# Altium schematic sheet Chipset.SchDoc
size A2; SheetNumber: 1; SheetTotal: 8
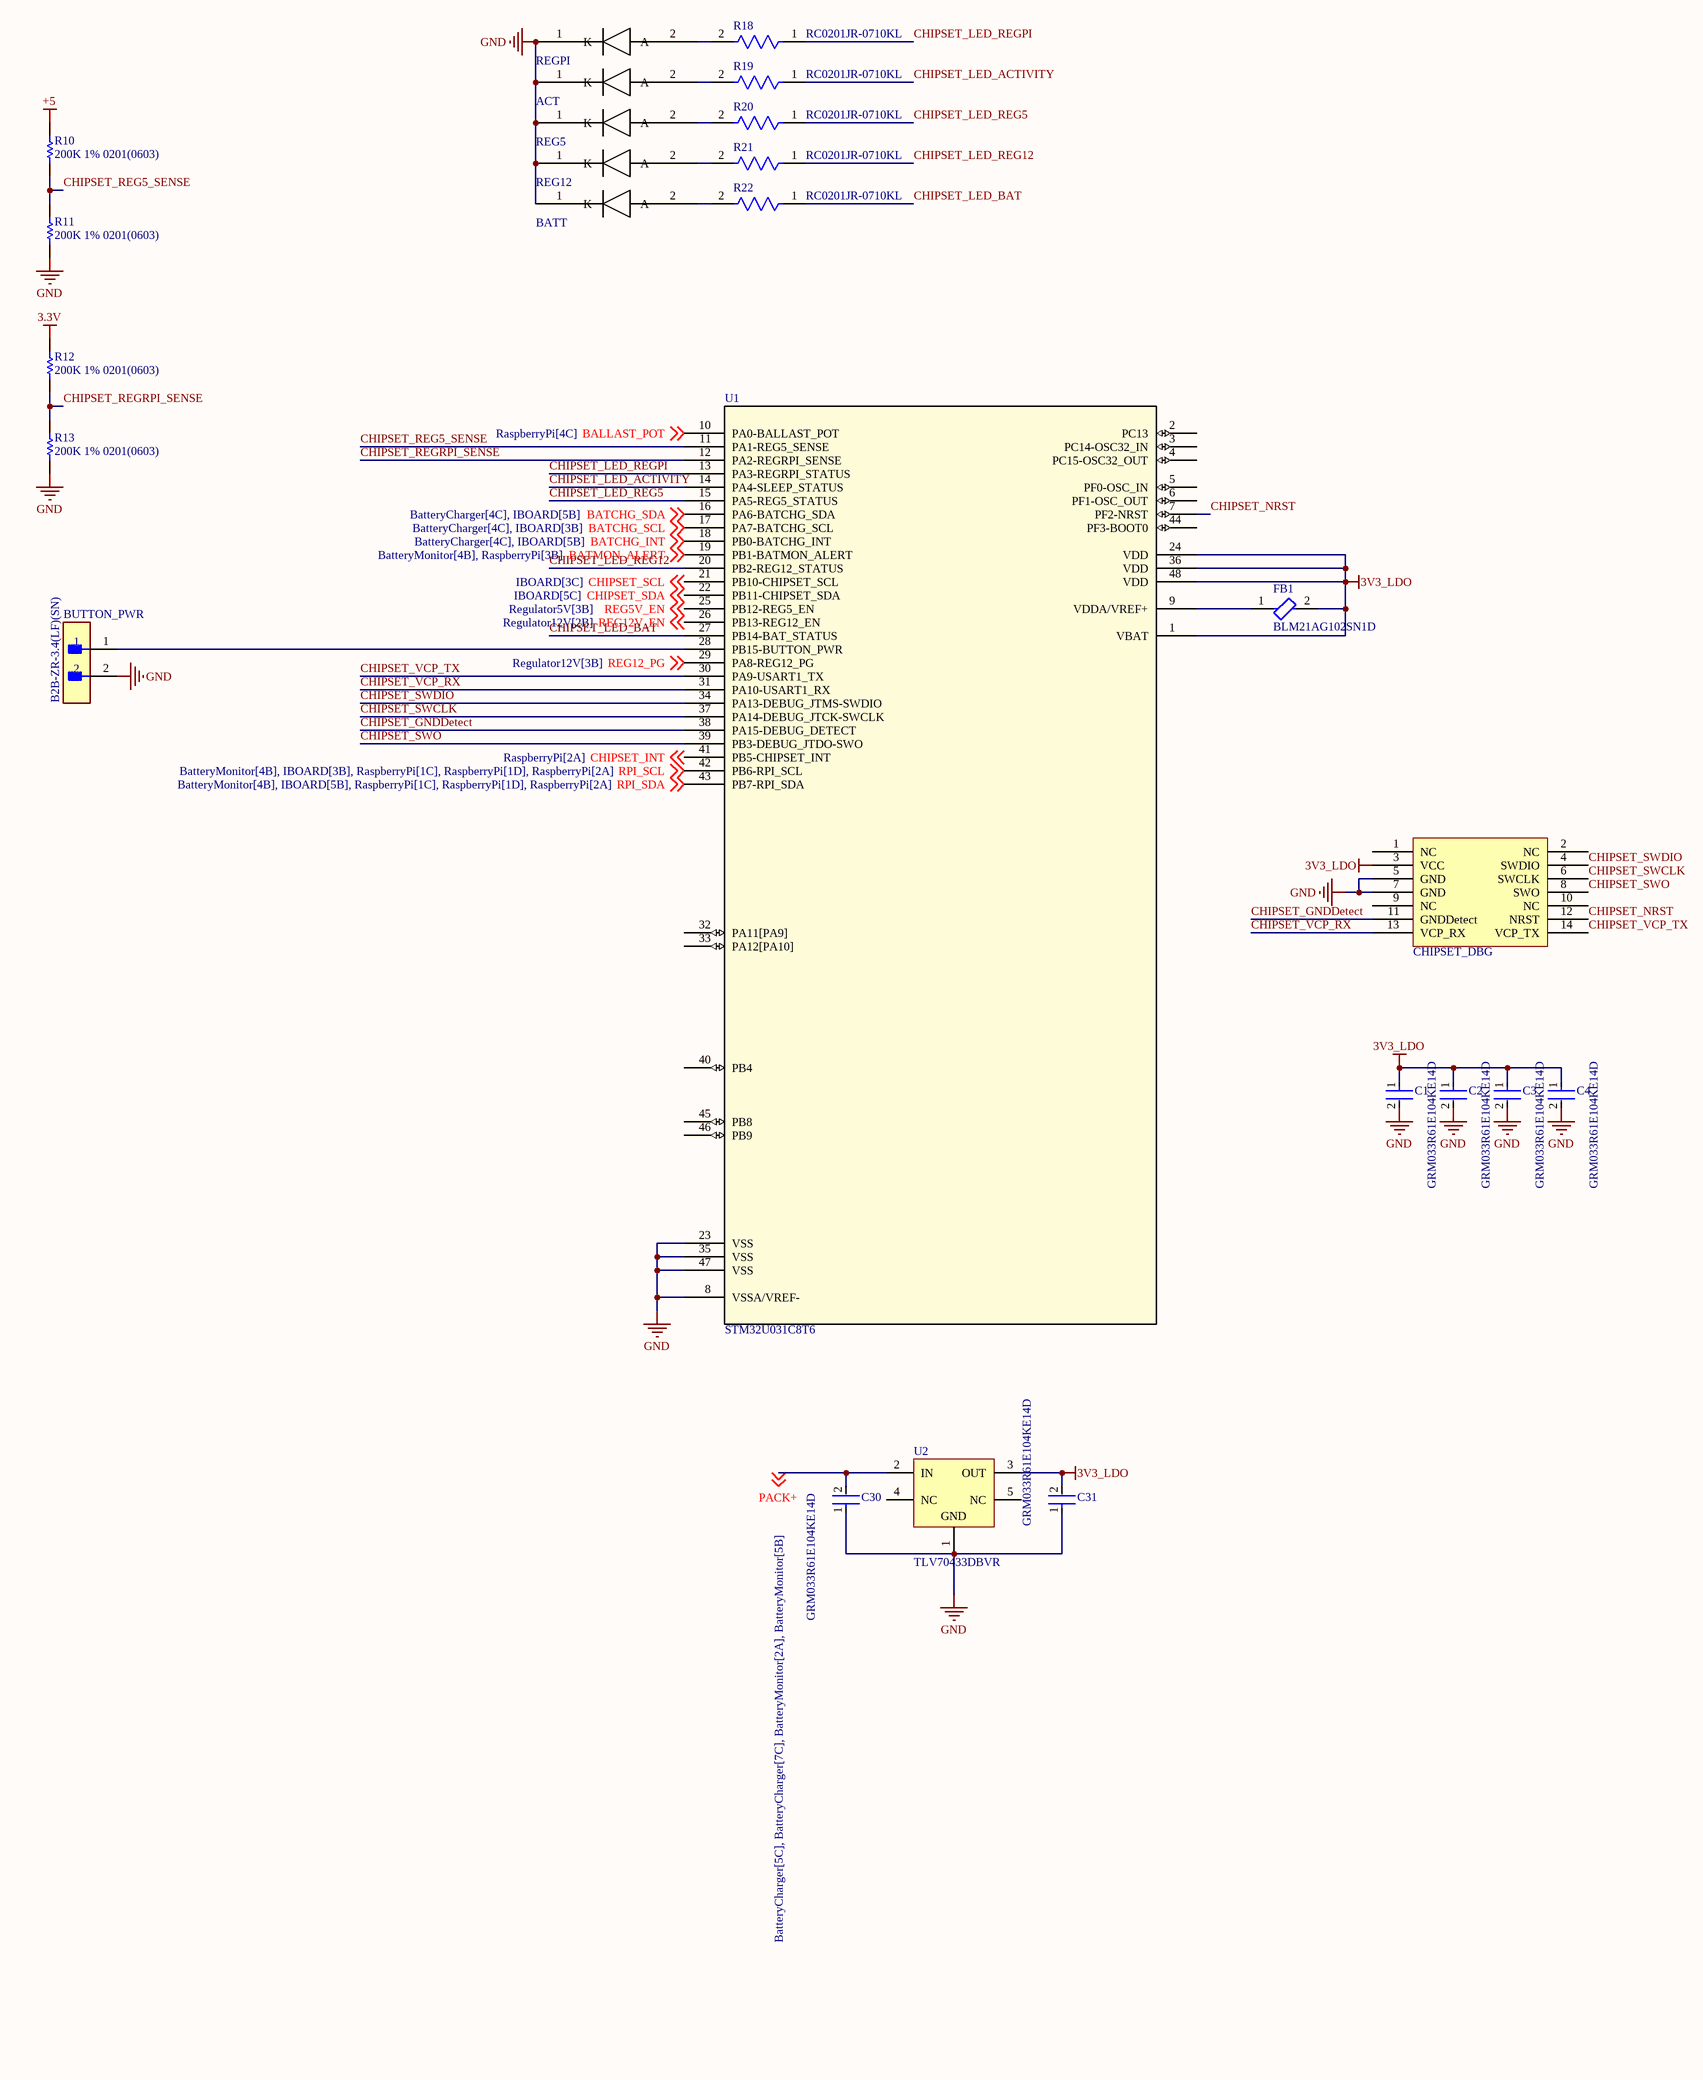
[diagram p0: Chipset.SchDoc]

## Parts
ACT  XL-1608SURC-06  [XL-1608SURC-06]  (value not drawn)
BATT  XL-1608SURC-06  [XL-1608SURC-06]  (value not drawn)
BUTTON_PWR  B2B-ZR-3.4(LF)(SN)  [FP-B2B-ZR-3_4_LF_SN-MFG]
C1  GRM033R61E104KE14D  [FP-GRM033-0_03-IPC_B]
C2  GRM033R61E104KE14D  [FP-GRM033-0_03-IPC_B]
C3  GRM033R61E104KE14D  [FP-GRM033-0_03-IPC_B]
C4  GRM033R61E104KE14D  [FP-GRM033-0_03-IPC_B]
C30  GRM033R61E104KE14D  [FP-GRM033-0_03-IPC_B]
C31  GRM033R61E104KE14D  [FP-GRM033-0_03-IPC_B]
CHIPSET_DBG  X1321WVS-2x07J-C40D53  [X1321WVS-2x07J-C40D53]  (value not drawn)
FB1  BLM21AG102SN1D  [FP-BLM21-0_2-t0_85-e0_5-MFG]
R10  200K 1% 0201(0603)  [RESC0201(0603)_N]
R11  200K 1% 0201(0603)  [RESC0201(0603)_N]
R12  200K 1% 0201(0603)  [RESC0201(0603)_N]
R13  200K 1% 0201(0603)  [RESC0201(0603)_N]
R18  RC0201JR-0710KL  [FP-RC0201-0_26-IPC_C]
R19  RC0201JR-0710KL  [FP-RC0201-0_26-IPC_C]
R20  RC0201JR-0710KL  [FP-RC0201-0_26-IPC_C]
R21  RC0201JR-0710KL  [FP-RC0201-0_26-IPC_C]
R22  RC0201JR-0710KL  [FP-RC0201-0_26-IPC_C]
REG5  XL-1608SURC-06  [XL-1608SURC-06]  (value not drawn)
REG12  XL-1608SURC-06  [XL-1608SURC-06]  (value not drawn)
REGPI  XL-1608SURC-06  [XL-1608SURC-06]  (value not drawn)
U1  STM32U031C8T6  [LQFP48_STM]
U2  TLV70433DBVR  [DBV0005A_M]

## Nets
3.3V: R12.2
3V3_LDO: C1.1 C2.1 C3.1 C4.1 C31.2 CHIPSET_DBG.3(VCC) FB1.2 U1.1(VBAT) U1.24(VDD) U1.36(VDD) U1.48(VDD) U2.3(OUT)
+5: R10.2
GND: ACT.1(K) BATT.1(K) BUTTON_PWR.2 C1.2 C2.2 C3.2 C4.2 C30.1 C31.1 CHIPSET_DBG.5(GND) CHIPSET_DBG.7(GND) R11.1 R13.1 REG5.1(K) REG12.1(K) REGPI.1(K) U1.8(VSSA/VREF-) U1.23(VSS) U1.35(VSS) U1.47(VSS) U2.1(GND)
BALLAST_POT: U1.10(PA0-BALLAST_POT) ; off-sheet BALLAST_POT
BATCHG_INT: U1.18(PB0-BATCHG_INT) ; off-sheet BATCHG_INT
BATCHG_SCL: U1.17(PA7-BATCHG_SCL) ; off-sheet BATCHG_SCL
BATCHG_SDA: U1.16(PA6-BATCHG_SDA) ; off-sheet BATCHG_SDA
BATMON_ALERT: U1.19(PB1-BATMON_ALERT) ; off-sheet BATMON_ALERT
CHIPSET_GNDDetect: CHIPSET_DBG.11(GNDDetect) U1.38(PA15-DEBUG_DETECT)
CHIPSET_INT: U1.41(PB5-CHIPSET_INT) ; off-sheet CHIPSET_INT
CHIPSET_LED_ACTIVITY: R19.1 U1.14(PA4-SLEEP_STATUS)
CHIPSET_LED_BAT: R22.1 U1.27(PB14-BAT_STATUS)
CHIPSET_LED_REG5: R20.1 U1.15(PA5-REG5_STATUS)
CHIPSET_LED_REG12: R21.1 U1.20(PB2-REG12_STATUS)
CHIPSET_LED_REGPI: R18.1 U1.13(PA3-REGRPI_STATUS)
CHIPSET_NRST: CHIPSET_DBG.12(NRST) U1.7(PF2-NRST)
CHIPSET_REG5_SENSE: R10.1 R11.2 U1.11(PA1-REG5_SENSE)
CHIPSET_REGRPI_SENSE: R12.1 R13.2 U1.12(PA2-REGRPI_SENSE)
CHIPSET_SCL: U1.21(PB10-CHIPSET_SCL) ; off-sheet CHIPSET_SCL
CHIPSET_SDA: U1.22(PB11-CHIPSET_SDA) ; off-sheet CHIPSET_SDA
CHIPSET_SWCLK: CHIPSET_DBG.6(SWCLK) U1.37(PA14-DEBUG_JTCK-SWCLK)
CHIPSET_SWDIO: CHIPSET_DBG.4(SWDIO) U1.34(PA13-DEBUG_JTMS-SWDIO)
CHIPSET_SWO: CHIPSET_DBG.8(SWO) U1.39(PB3-DEBUG_JTDO-SWO)
CHIPSET_VCP_RX: CHIPSET_DBG.13(VCP_RX) U1.31(PA10-USART1_RX)
CHIPSET_VCP_TX: CHIPSET_DBG.14(VCP_TX) U1.30(PA9-USART1_TX)
PACK+: C30.2 U2.2(IN) ; off-sheet PACK+
REG5V_EN: U1.25(PB12-REG5_EN) ; off-sheet REG5V_EN
REG12_PG: U1.29(PA8-REG12_PG) ; off-sheet REG12_PG
REG12V_EN: U1.26(PB13-REG12_EN) ; off-sheet REG12V_EN
RPI_SCL: U1.42(PB6-RPI_SCL) ; off-sheet RPI_SCL
RPI_SDA: U1.43(PB7-RPI_SDA) ; off-sheet RPI_SDA
NetACT_2: ACT.2(A) R19.2
NetBATT_2: BATT.2(A) R22.2
NetBUTTON_PWR_1: BUTTON_PWR.1 U1.28(PB15-BUTTON_PWR)
NetFB1_1: FB1.1 U1.9(VDDA/VREF+)
NetR18_2: R18.2 REGPI.2(A)
NetR20_2: R20.2 REG5.2(A)
NetR21_2: R21.2 REG12.2(A)

Not connected (* = marked no-connect by the designer): CHIPSET_DBG 1(NC) 2(NC) 9(NC) 10(NC); U1 2(PC13) 3(PC14-OSC32_IN) 4(PC15-OSC32_OUT) 5(PF0-OSC_IN) 6(PF1-OSC_OUT) 32(PA11[PA9]) 33(PA12[PA10]) 40(PB4) 44(PF3-BOOT0) 45(PB8) 46(PB9); U2 4(NC) 5(NC)

## Library data of the parts
BUTTON_PWR = CMP-17439-000601-1: CONN HEADER VERT 2POS 1.5MM; Mated Stacking Heights: 5.6mm; Voltage Rating: 50V; Number of Positions: 2; Termination: Press-Fit; Insulation Color: Natural; Pitch: 1.5mm; Number of Rows: 1; Fastening Type: Detent; Insulation Material: Nylon; Contact Shape: Circular; Lead Free: Lead Free; Series: ZH; Connector Type: Header; Contact Type: Male Pin; Packaging: Bulk; Contact Finish - Mating: TIN; Mount: Through Hole; Contact Material: Brass; Flammability Rating: UL94 V-0
C1-C4 C30 C31 = CMP-06035-036234-1: Chip Multilayer Ceramic Capacitors for General Purpose, 0201, 0.10uF, X5R, 15%, 10%, 25V; Capacitance: 100nF; Case/Package: 0201; Mount: Surface Mount; Resistor Type: Ceramic; Package Quantity: 15000; Height: 0.3mm; Length: 0.024inch; Weight: 1.2E-05oz; Dielectric: X5R; Thickness: 0.013inch; Max Operating Temperature: 85°C; Case Code (Imperial): 0201; Voltage Rating: 25V; Case Code (Metric): 0603; Voltage Rating (DC): 25V; Width: 0.012inch; Termination: SMD/SMT; Tolerance: 10%; Min Operating Temperature: -55°C; Packaging: Tape and Reel; Lead Free: Lead Free
FB1 = CMP-0686-00665-3: Chip Ferrite Bead, 0805, 1000Ω @ 100MHz, 0.27Ω, 25%, 600mA; Material: Steel; Number of Lines: 1; Current Rating: 500mA; Max DC Current: 200mA; Impedance: 1kR; DC Resistance (DCR): 280mR; Shielding: Unshielded; Length: 2mm; Max Current Rating: 600mA; Max Operating Temperature: 125°C; Lead Free: Lead Free; Test Frequency: 100MHz; Number of Pins: 2; Height: 0.85mm; Package Quantity: 1; Termination: SMD/SMT; Depth: 1.25mm; Radiation Hardening: No; Case Code (Metric): 2012; Tolerance: 25%; Core Material: Ferrite; Min Operating Temperature: -55°C; Case Code (Imperial): 0805; Weight: 0.000194oz; DC Current: 200mA; Case/Package: 0805; REACH SVHC: No SVHC; Frequency: 100MHz; Military Standard: Not; Number of Circuits: 1; Width: 1.25mm; Packaging: Tape and Reel
R10-R13 = CMP-1010-00674-1: 200K 0.05W 1% 0201 (0603 Metric)  SMD; Value: 200000.00 Ohm; Case-EIA: 0201; Case-Metric: 0603; Technology: SMT; Tolerance: 1 %; Power: 0.05 W
R18-R22 = CMP-03412-037826-1: RES SMD 10K OHM 5% 1/20W 0201; Voltage Rating: 25V; Max Power Dissipation: 50mW; Temperature Coefficient: 200ppm/°C; Resistance: 10kR; Min Operating Temperature: -55°C; Packaging: Tape and Reel; Tolerance: 5%; Length: 0.6mm; Contact Plating: Tin; Features: Moisture Resistant; Radiation Hardening: No; Military Standard: Not; Voltage Rating (DC): 25V; Termination: SMD/SMT; Size Code: 0201; Resistance Tolerance: 5%; Case Code (Imperial): 0201; Resistor Type: Thick Film; Depth: 0.3mm; Series: RC; Lead Free: Lead Free; Power Rating: 50mW; Number of Terminations: 2; Case Code (Metric): 0603; RoHS Compliant: Yes; Max Operating Temperature: 125°C; Construction: Rectangular; Case/Package: 0201
U1 = STM32U031C8T6: No Description Available; Mfr_Name: STMicroelectronics; RefDes: RefDes; Type: Type
U2 = CMP-0394-00651-2: Single Output LDO, 150 mA, Fixed 3.3 V Output, 2.5 to 24 V Input, with Ultra-Low IQ, 5-pin SOT-23 (DBV), -40 to 125 degC, Green (RoHS & no Sb/Br); Manufacturer: Texas Instruments; Vdo(Typ)(mV): 400; Accuracy(%): 2; Vin(Min)(V): 2.5; Vin(Max)(V): 24; SubFamily: Single Channel LDO; Iq(Typ)(mA): 0.003; Fixed Output Options(V): 3.3; Iout(Max)(A): 0.15; DatasheetVersion: SBVS148C; ComponentLink1URL: http://www.ti.com/; ComponentLink3URL: http://www.ti.com/litv/pdf/mpds018i; Code_JEDEC: MO-178; PackageReference: DBV0005A; PackageDescription: 5-Pin Plastic Small Outline, Body 1.60 Ãƒâ€” 2.90 mm, Pitch 0.95 mm; Mounting Technology: Surface Mount; ComponentLink1Description: Manufacturer URL; Vout Adj(Min)(V): 3.3; PartNumber: TLV70433DBVR; ComponentLink2Description: Datasheet; PackageVersion: 4073253-4/K; ComponentLink2URL: http://www.ti.com/general/docs/lit/getliterature.tsp?genericPartNumber=TLV70433&fileType=pdf; ComponentLink3Description: Package Specification; Vout Adj(Max)(V): 3.3; Eco-Plan: Green (RoHS & no Sb/Br)